# Altium project Badge_V2.PrjPCB
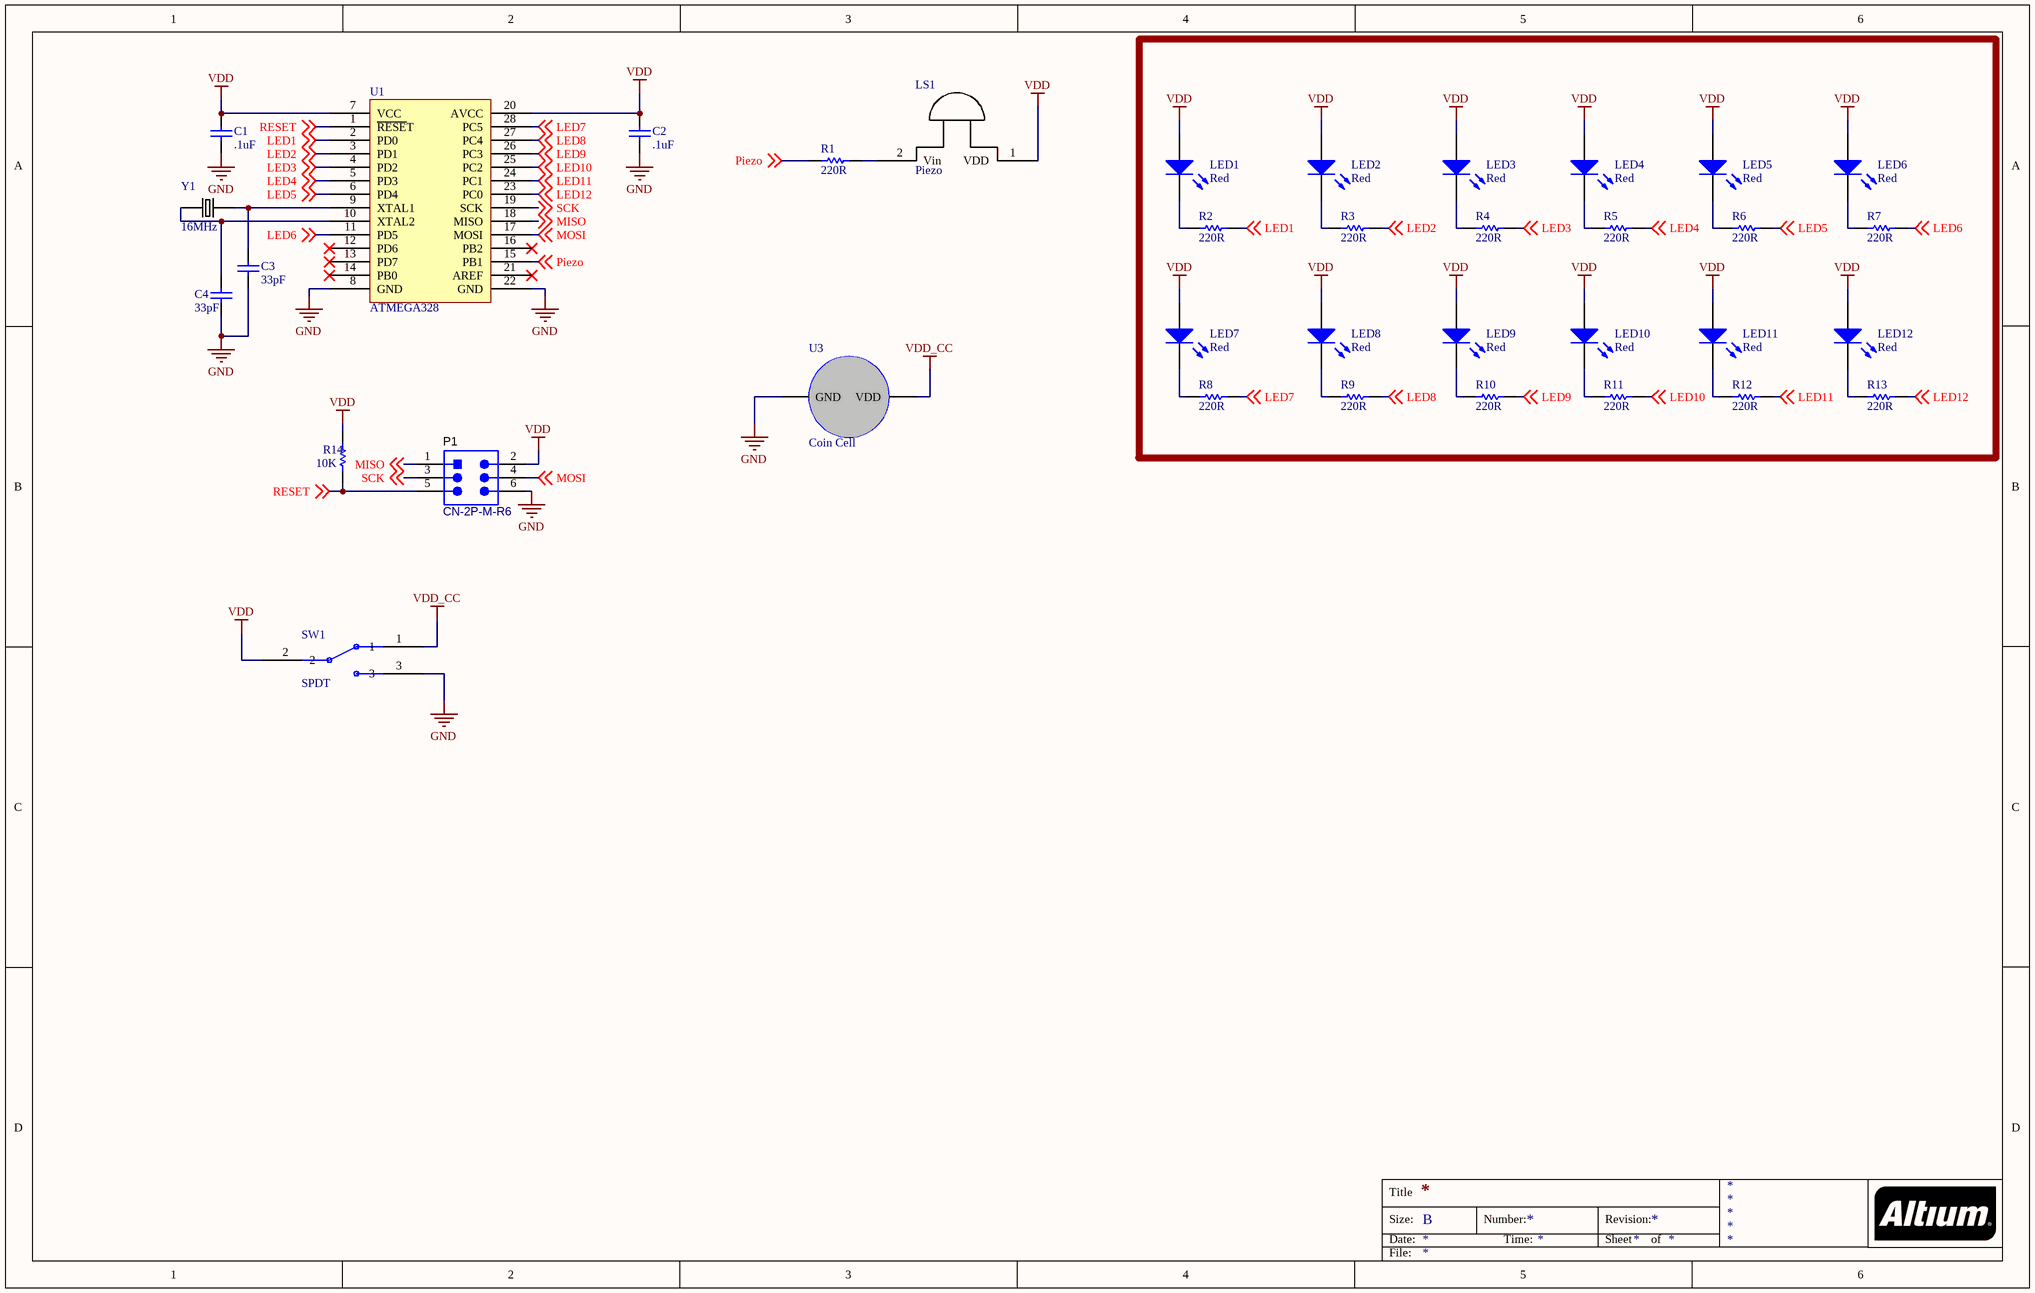
[diagram p0: Badge_V2.SchDoc]
1 sheet, 36 parts. Net scope: global (net labels, ports and power ports of the same name join across sheets).
Board file: Badge_V2.PcbDoc

## Sheet Badge_V2.SchDoc
size B

### Parts
C1  .1uF  [CAPC0805(2012)145_L]
C2  .1uF  [CAPC0805(2012)145_L]
C3  33pF  [CAPC0805(2012)145_L]
C4  33pF  [CAPC0805(2012)145_L]
LED1  Red  [LED_0805]
LED2  Red  [LED_0805]
LED3  Red  [LED_0805]
LED4  Red  [LED_0805]
LED5  Red  [LED_0805]
LED6  Red  [LED_0805]
LED7  Red  [LED_0805]
LED8  Red  [LED_0805]
LED9  Red  [LED_0805]
LED10  Red  [LED_0805]
LED11  Red  [LED_0805]
LED12  Red  [LED_0805]
LS1  Piezo  [Piezo]
P1  CN-2P-M-R6  [HRWN-M20-9980346_V]
R1  220R  [RESC0805(2012)_M]
R2  220R  [RESC0805(2012)_M]
R3  220R  [RESC0805(2012)_M]
R4  220R  [RESC0805(2012)_M]
R5  220R  [RESC0805(2012)_M]
R6  220R  [RESC0805(2012)_M]
R7  220R  [RESC0805(2012)_M]
R8  220R  [RESC0805(2012)_M]
R9  220R  [RESC0805(2012)_M]
R10  220R  [RESC0805(2012)_M]
R11  220R  [RESC0805(2012)_M]
R12  220R  [RESC0805(2012)_M]
R13  220R  [RESC0805(2012)_M]
R14  10K  [RESC0805(2012)_M]
SW1  SPDT  [EG1218_EG1218]
U1  ATMEGA328  [1-2199298-9]
U3  Coin Cell  [Batt]
Y1  16MHz  [XTAL_ECS-160-20-3X-TR]

### Nets
GND: C1.1 C2.1 C3.1 C4.1 P1.6 SW1.3 U1.8(GND) U1.22(GND) U3.GND
VDD: C1.2 C2.2 LED1.2(A) LED2.2(A) LED3.2(A) LED4.2(A) LED5.2(A) LED6.2(A) LED7.2(A) LED8.2(A) LED9.2(A) LED10.2(A) LED11.2(A) LED12.2(A) LS1.1(VDD) P1.2 R14.1 SW1.2 U1.7(VCC) U1.20(AVCC)
VDD_CC: SW1.1 U3.VDD
LED1: R2.2 U1.2(PD0) ; off-sheet LED1
LED2: R3.2 U1.3(PD1) ; off-sheet LED2
LED3: R4.2 U1.4(PD2) ; off-sheet LED3
LED4: R5.2 U1.5(PD3) ; off-sheet LED4
LED5: R6.2 U1.6(PD4) ; off-sheet LED5
LED6: R7.2 U1.11(PD5) ; off-sheet LED6
LED7: R8.2 U1.28(PC5) ; off-sheet LED7
LED8: R9.2 U1.27(PC4) ; off-sheet LED8
LED9: R10.2 U1.26(PC3) ; off-sheet LED9
LED10: R11.2 U1.25(PC2) ; off-sheet LED10
LED11: R12.2 U1.24(PC1) ; off-sheet LED11
LED12: R13.2 U1.23(PC0) ; off-sheet LED12
MISO: P1.1 U1.18(MISO) ; off-sheet MISO
MOSI: P1.4 U1.17(MOSI) ; off-sheet MOSI
Piezo: R1.1 U1.15(PB1) ; off-sheet Piezo
RESET: P1.5 R14.2 U1.1(~{RESE}T) ; off-sheet RESET
SCK: P1.3 U1.19(SCK) ; off-sheet SCK
NetC3_2: C3.2 U1.9(XTAL1) Y1.2
NetC4_2: C4.2 U1.10(XTAL2) Y1.1
NetLED1_1: LED1.1(K) R2.1
NetLED2_1: LED2.1(K) R3.1
NetLED3_1: LED3.1(K) R4.1
NetLED4_1: LED4.1(K) R5.1
NetLED5_1: LED5.1(K) R6.1
NetLED6_1: LED6.1(K) R7.1
NetLED7_1: LED7.1(K) R8.1
NetLED8_1: LED8.1(K) R9.1
NetLED9_1: LED9.1(K) R10.1
NetLED10_1: LED10.1(K) R11.1
NetLED11_1: LED11.1(K) R12.1
NetLED12_1: LED12.1(K) R13.1
NetLS1_2: LS1.2(Vin) R1.2

Not connected (* = marked no-connect by the designer): U1 12(PD6)* 13(PD7)* 14(PB0)* 16(PB2)* 21(AREF)*

### Notes on the sheet
- Title
- Size:
- Date:
- B
- Number:
- Time:
- Revision:
- Sheet
- of
- File:

### Library data of the parts
C1 C2 = CAP100n: capacitor; Manufacturer: Yageo; MPN: CC0805ZRY5V9BB104; Value: .1uF
C3 C4 = CAP33p: capacitor; Manufacturer: Yageo; MPN: CC0805JRNPO9BN330; Value: 33pF
LED1-LED12 = LED_0805: Red 625nm LED Indication - Discrete 2V 0805 (2012 Metric); MPN: 150080RS75000; Manufacturer: Würth Elektronik; Value: Red
LS1 = Piezo: AUDIO PIEZO TRANSDUCER 30V TH; MPN: PS1240P02BT; Manufacturer: TDK Corporation; Value: Piezo
R1-R13 = RES: resistor; Manufacturer: Yageo; MPN: RC0805JR-071KL; Value: 220R
R14 = RES10K: resistor; Manufacturer: Yageo; MPN: RC0603JR-0710KL; Value: 10K
SW1 = SPDT_Switch: Slide Switch SPDT Through Hole; MPN: EG1218; Manufacturer: E-Switch; Value: SPDT
U1 = ATMEGA328-PU: AVR AVR® ATmega Microcontroller IC 8-Bit 20MHz 32KB (16K x 16) FLASH 28-PDIP; Manufacturer: Microchip Technology; Value: ATMEGA328; MPN: ATMEGA328-PU
U3 = Batt: Battery Retainer Coin, 20.0mm 1 Cell SMD (SMT) Tab; MPN: 3034TR; Manufacturer: Keystone Electronics; Value: Coin Cell
Y1 = ECS-160-20-3X-TR: 16MHz Â±30ppm Crystal 20pF 50 Ohms HC-49/US; Manufacturer: ECS Inc.; MPN: ECS-160-20-3X-TR; Value: 16MHz